# EAGLE design PiBoard1.1 (EAGLE 7.6.0)
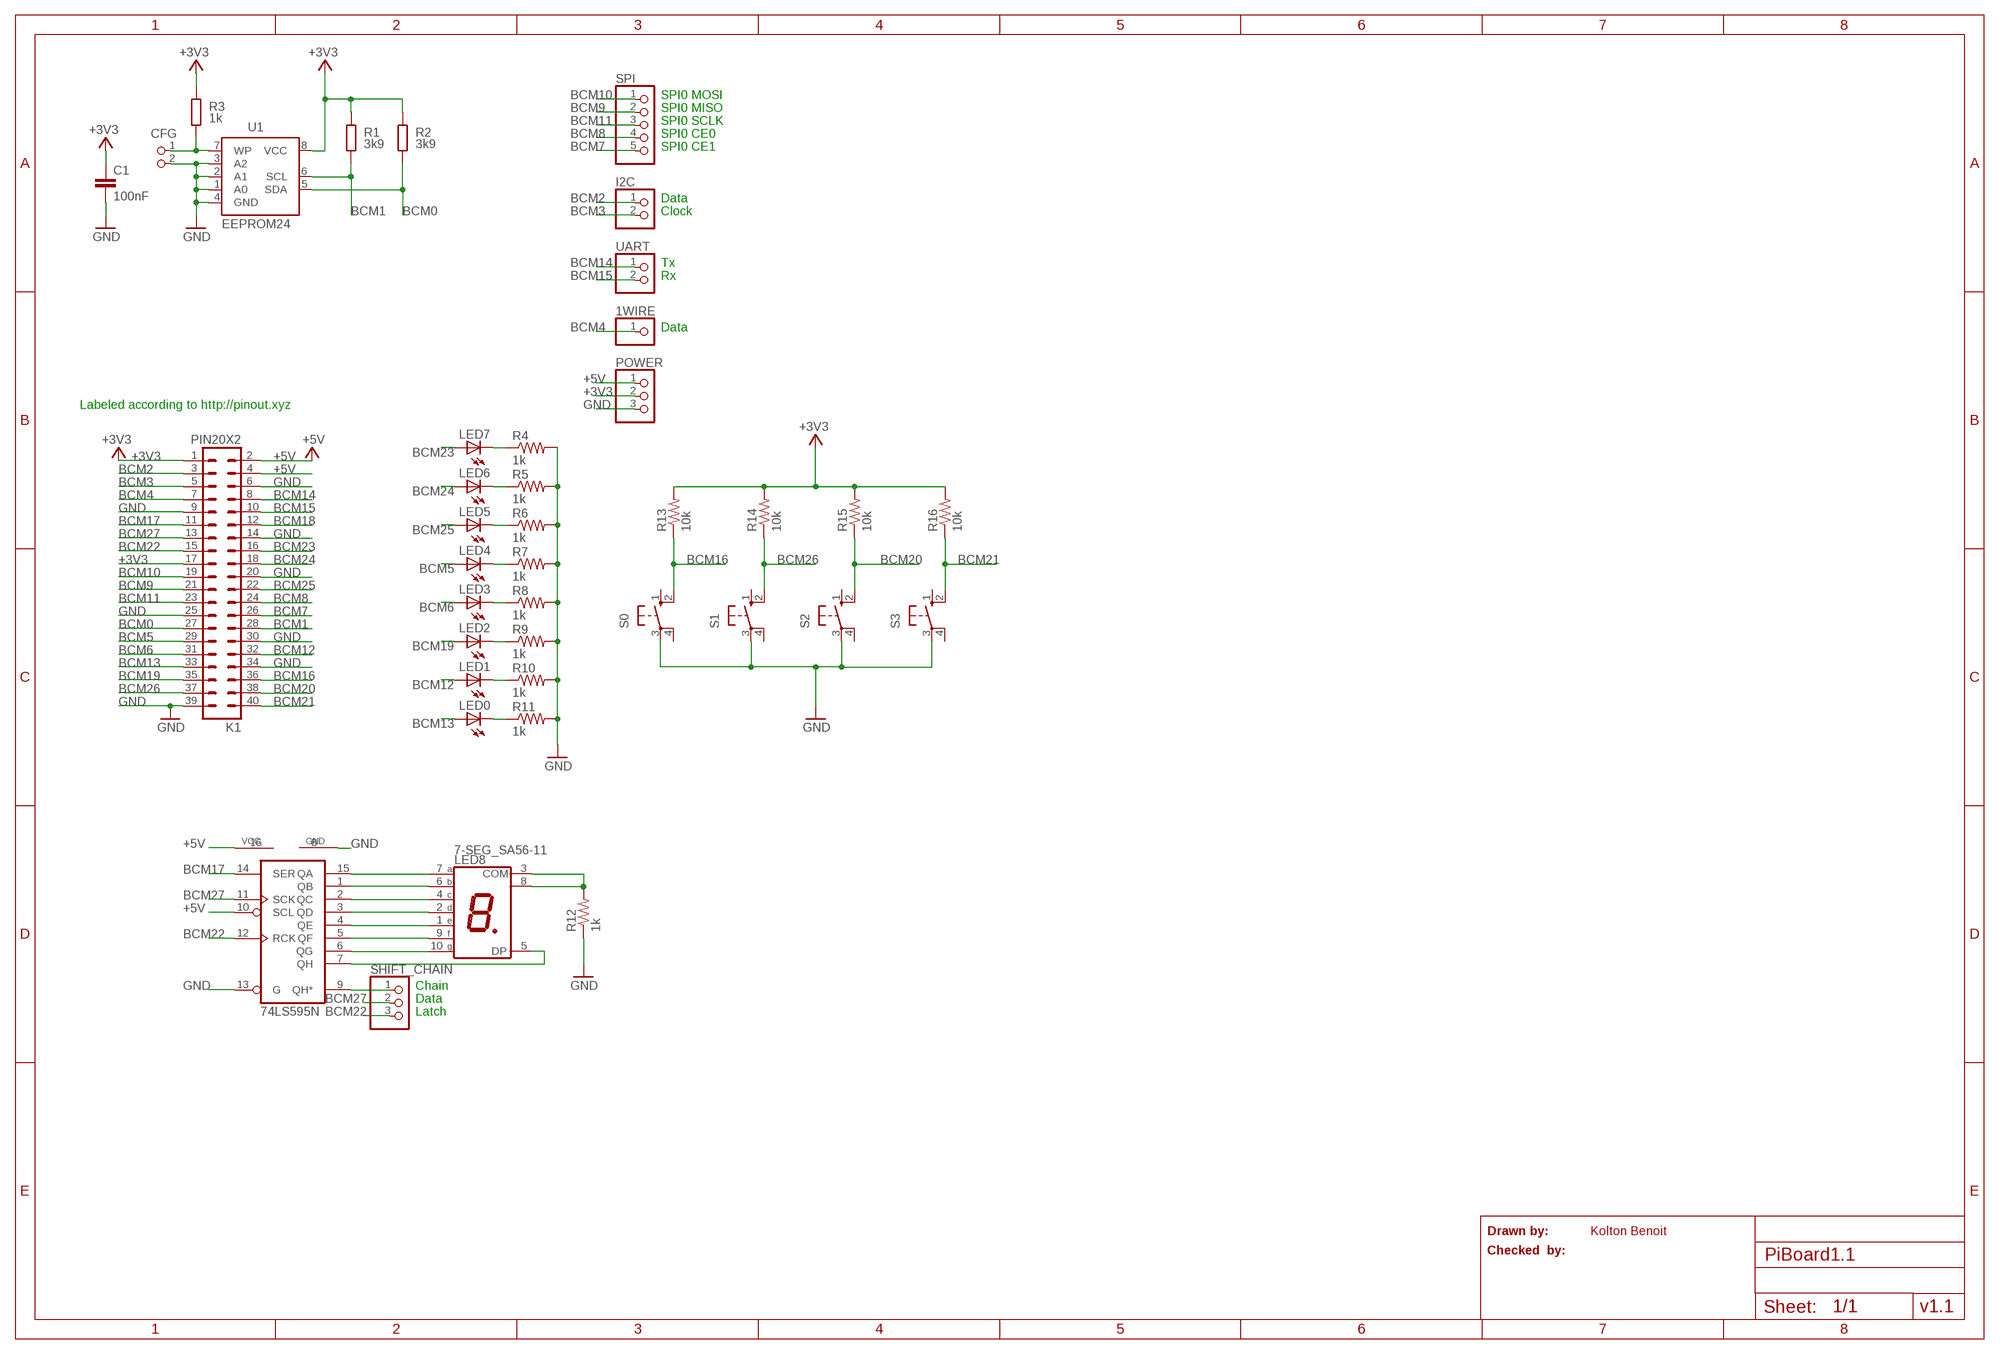
[diagram p0: schematic, sheet 1]

## Parts
1WIRE  PINHD-1X1  [1X01]
C1  100nF  C-EUC0805K  [C0805K]
CFG  PIN2_100  [PIN_W_2]
I2C  PINHD-1X2  [1X02]
K1  PIN20X2  [PIN_20X2]
LED0  LED3MM  [LED3MM]
LED1  LED3MM  [LED3MM]
LED2  LED3MM  [LED3MM]
LED3  LED3MM  [LED3MM]
LED4  LED3MM  [LED3MM]
LED5  LED3MM  [LED3MM]
LED6  LED3MM  [LED3MM]
LED7  LED3MM  [LED3MM]
LED8  7-SEG_SA56-11  [SA56-11]
POWER  PINHD-1X3  [1X03]
R1  3k9  R-EU_M0805  [M0805@1]
R2  3k9  R-EU_M0805  [M0805@1]
R3  1k  R-EU_M0805  [M0805@1]
R4  1k  R-US_0204/7  [0204/7]
R5  1k  R-US_0204/7  [0204/7]
R6  1k  R-US_0204/7  [0204/7]
R7  1k  R-US_0204/7  [0204/7]
R8  1k  R-US_0204/7  [0204/7]
R9  1k  R-US_0204/7  [0204/7]
R10  1k  R-US_0204/7  [0204/7]
R11  1k  R-US_0204/7  [0204/7]
R12  1k  R-US_0204/7  [0204/7]
R13  10k  R-US_0204/7  [0204/7]
R14  10k  R-US_0204/7  [0204/7]
R15  10k  R-US_0204/7  [0204/7]
R16  10k  R-US_0204/7  [0204/7]
S0  10-XX  [B3F-10XX]
S1  10-XX  [B3F-10XX]
S2  10-XX  [B3F-10XX]
S3  10-XX  [B3F-10XX]
SHIFT  74LS595N  [DIL16]
SHIFT_CHAIN  PINHD-1X3  [1X03]
SPI  PINHD-1X5  [1X05]
U1  EEPROM24  [SOIC8]
UART  PINHD-1X2  [1X02]

## Nets
+3V3: C1.1 K1.1 K1.17 POWER.2 R1.2 R2.2 R3.2 R13.2 R14.2 R15.2 R16.2 U1.8(VCC)
+5V: K1.2 K1.4 POWER.1 SHIFT.10(SCL) SHIFT.16(VCC)
BCM0: K1.27 R2.1 U1.5(SDA)
BCM1: K1.28 R1.1 U1.6(SCL)
BCM2: I2C.1 K1.3
BCM3: I2C.2 K1.5
BCM4: 1WIRE.1 K1.7
BCM5: K1.29 LED4.A
BCM6: K1.31 LED3.A
BCM7: K1.26 SPI.5
BCM8: K1.24 SPI.4
BCM9: K1.21 SPI.2
BCM10: K1.19 SPI.1
BCM11: K1.23 SPI.3
BCM12: K1.32 LED1.A
BCM13: K1.33 LED0.A
BCM14: K1.8 UART.1
BCM15: K1.10 UART.2
BCM16: K1.36 R13.1 S0.2(S1)
BCM17: K1.11 SHIFT.14(SER)
BCM18: K1.12
BCM19: K1.35 LED2.A
BCM20: K1.38 R15.1 S2.2(S1)
BCM21: K1.40 R16.1 S3.2(S1)
BCM22: K1.15 SHIFT.12(RCK) SHIFT_CHAIN.3
BCM23: K1.16 LED7.A
BCM24: K1.18 LED6.A
BCM25: K1.22 LED5.A
BCM26: K1.37 R14.1 S1.2(S1)
BCM27: K1.13 SHIFT.11(SCK) SHIFT_CHAIN.2
GND: C1.2 CFG.2 K1.6 K1.9 K1.14 K1.20 K1.25 K1.30 K1.34 K1.39 POWER.3 R4.2 R5.2 R6.2 R7.2 R8.2 R9.2 R10.2 R11.2 R12.1 S0.3(P) S1.3(P) S2.3(P) S3.3(P) SHIFT.8(GND) SHIFT.13(G) U1.1(A0) U1.2(A1) U1.3(A2) U1.4(GND)
N$3: CFG.1 R3.1 U1.7(WP)
N$4: LED8.7(A) SHIFT.15(QA)
N$5: LED8.6(B) SHIFT.1(QB)
N$6: LED8.4(C) SHIFT.2(QC)
N$7: LED8.2(D) SHIFT.3(QD)
N$8: LED8.1(E) SHIFT.4(QE)
N$9: LED8.9(F) SHIFT.5(QF)
N$10: LED8.10(G) SHIFT.6(QG)
N$11: LED8.5(DP) SHIFT.7(QH)
N$16: LED0.K(C) R11.1
N$17: LED1.K(C) R10.1
N$18: LED2.K(C) R9.1
N$19: LED3.K(C) R8.1
N$20: LED4.K(C) R7.1
N$21: LED5.K(C) R6.1
N$22: LED6.K(C) R5.1
N$23: LED7.K(C) R4.1
N$24: SHIFT.9(QH*) SHIFT_CHAIN.1
N$25: LED8.3(COM) LED8.8(COM) R12.2
Unconnected: S0.1(S) S0.4(P1) S1.1(S) S1.4(P1) S2.1(S) S2.4(P1) S3.1(S) S3.4(P1)

## Notes on the sheet
- SPI0 MOSI
- SPI0 MISO
- SPI0 SCLK
- SPI0 CE0
- SPI0 CE1
- Data
- Clock
- Tx
- Rx
- Data
- Labeled according to http://pinout.xyz
- Chain
- Data
- Latch
- Drawn by: | Kolton Benoit
- Checked  by:
- v1.1

## Library data of the parts
1WIRE = pinhead:PINHD-1X1: PIN HEADER
C1 = resistor:C-EU: CAPACITOR, European symbol; DIELECTRIC: X7R
CFG = FLYFISH:PIN2
I2C UART = pinhead:PINHD-1X2: PIN HEADER
K1 = FLYFISH:PIN20X2
LED0 LED1-LED7 = led:LED: LED OSRAM: - CHIPLED LG R971, LG N971, LY N971, LG Q971, LY Q971, LO R971, LY R971 LH N974, LH R974 LS Q976, LO Q976, LY Q976 LO Q996 - Hyper CHIPLED LW Q18S LB Q993, LB Q99A, LB R99A - SideLED LS A670, LO A670, LY A670, LG A670, LP A670 LB A673, LV A673, LT A673, LW A673 LH A674 LY A675 LS A676, LA A676, LO A676, LY A676, LW A676 LS A679, LY A679, LG A679 - Hyper Micro SIDELED® LS Y876, LA Y876, LO Y876, LY Y876 LT Y87S - SmartLED LW L88C, LW L88S LB L89C, LB L89S, LG L890 LS L89K, LO L89K, LY L89K LS L896, LA L896, LO L896, LY L896 - TOPLED LS T670, LO T670, LY T670, LG T670, LP T670 LSG T670, LSP T670, LSY T670, LOP T670, LYG T670 LG T671, LOG T671, LSG T671 LB T673, LV T673, LT T673, LW T673 LH T674 LS T676, LA T676, LO T676, LY T676, LB T676, LH T676, LSB T676, LW T676 LB T67C, LV T67C, LT T67C, LS T67K, LO T67K, LY T67K, LW E67C LS E67B, LA E67B, LO E67B, LY E67B, LB E67C, LV E67C, LT E67C LW T67C LS T679, LY T679, LG T679 LS T770, LO T770, LY T770, LG T770, LP T770 LB T773, LV T773, LT T773, LW T773 LH T774 LS E675, LA E675, LY E675, LS T675 LS T776, LA T776, LO T776, LY T776, LB T776 LHGB T686 LT T68C, LB T68C - Hyper Mini TOPLED® LB M676 - Mini TOPLED Santana® LG M470 LS M47K, LO M47K, LY M47K Source: http://www.osram.convergy.de LUXEON: - LUMILED® LXK2-PW12-R00, LXK2-PW12-S00, LXK2-PW14-U00, LXK2-PW14-V00 LXK2-PM12-R00, LXK2-PM12-S00, LXK2-PM14-U00 LXK2-PE12-Q00, LXK2-PE12-R00, LXK2-PE12-S00, LXK2-PE14-T00, LXK2-PE14-U00 LXK2-PB12-K00, LXK2-PB12-L00, LXK2-PB12-M00, LXK2-PB14-N00, LXK2-PB14-P00, LXK2-PB14-Q00 LXK2-PR12-L00, LXK2-PR12-M00, LXK2-PR14-Q00, LXK2-PR14-R00 LXK2-PD12-Q00, LXK2-PD12-R00, LXK2-PD12-S00 LXK2-PH12-R00, LXK2-PH12-S00 LXK2-PL12-P00, LXK2-PL12-Q00, LXK2-PL12-R00 Source: www.luxeon.com KINGBRIGHT: KA-3528ASYC Source: www.kingbright.com
LED8 = display-kingbright:7-SEG_: Kingbright 14.2mm (0.56 INCH) SINGLE DIGIT NUMERIC DUISPLAY Source: SA56-11EWA(Ver1189471036.pdf; OC_FARNELL: unknown; OC_NEWARK: unknown
POWER SHIFT_CHAIN = pinhead:PINHD-1X3: PIN HEADER
R1-R3 = resistor:R-EU_: RESISTOR, European symbol; TOLERANCE: 5%
R4-R16 = resistor:R-US_: RESISTOR, American symbol
S0 S1-S3 = switch-omron:10-XX: OMRON SWITCH; MPN: B3F-1000; OC_FARNELL: 176432; OC_NEWARK: 36M3542
SHIFT = 74xx-us:74*595: 8-bit SHIFT REGISTER, output latch
SPI = pinhead:PINHD-1X5: PIN HEADER
U1 = FLYFISH:EEPROM24

## Board
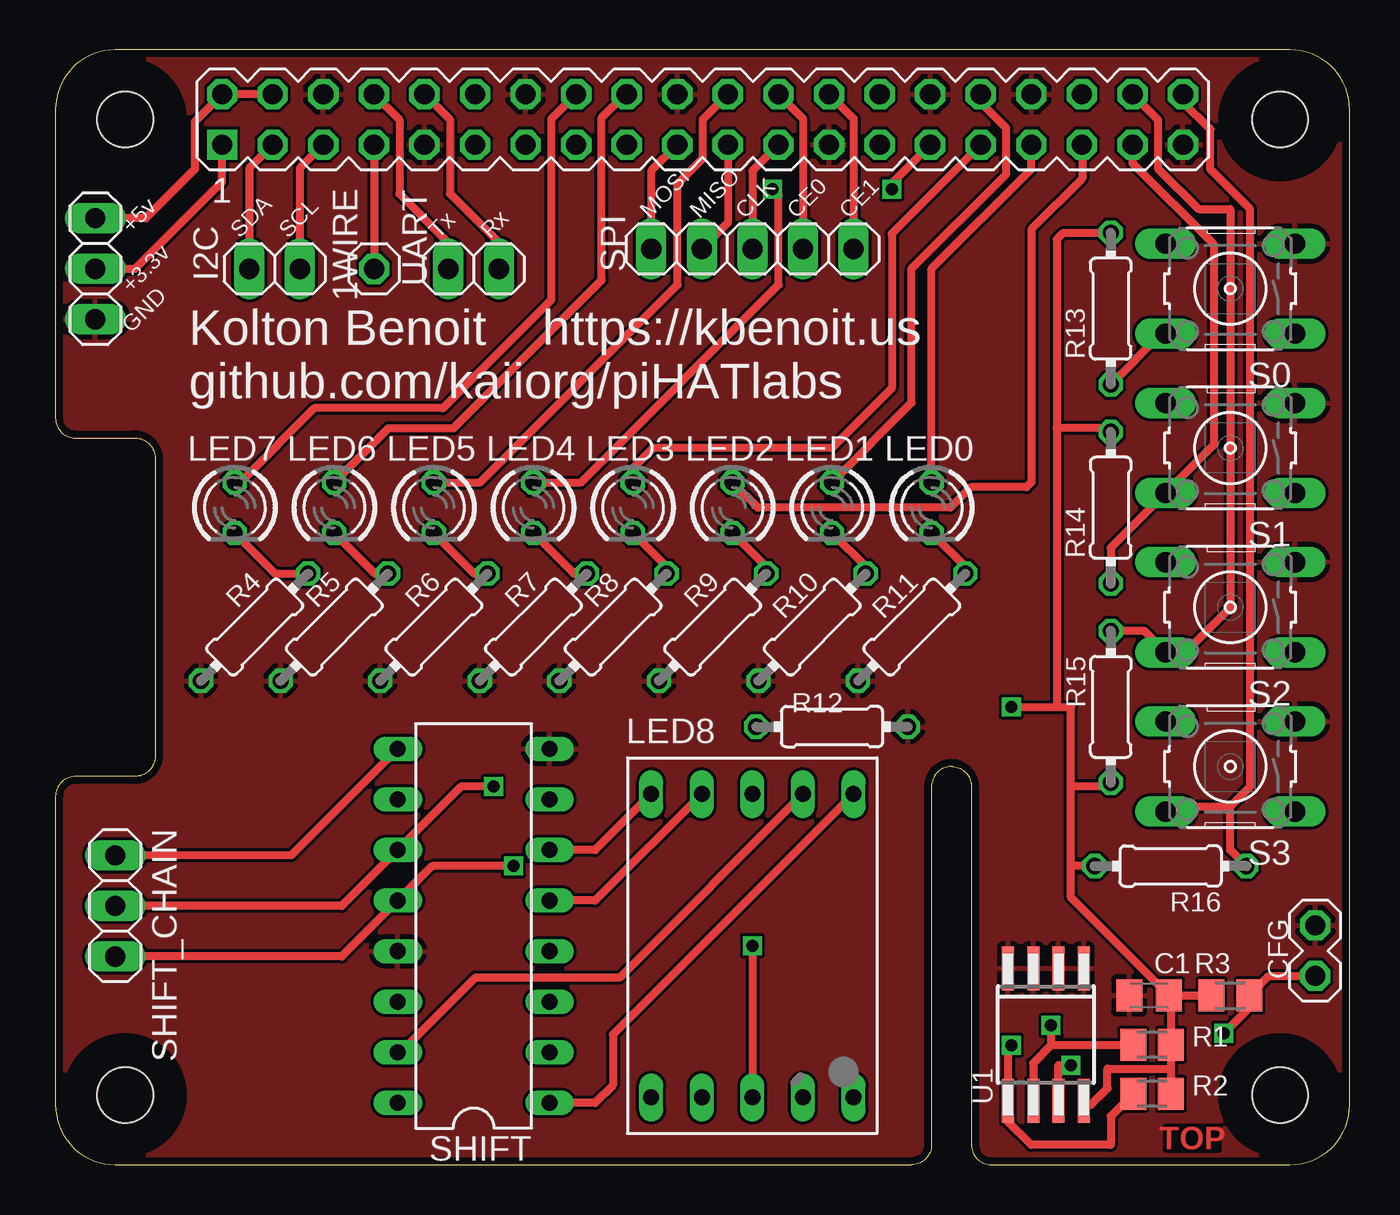
[diagram p1: board, top side]
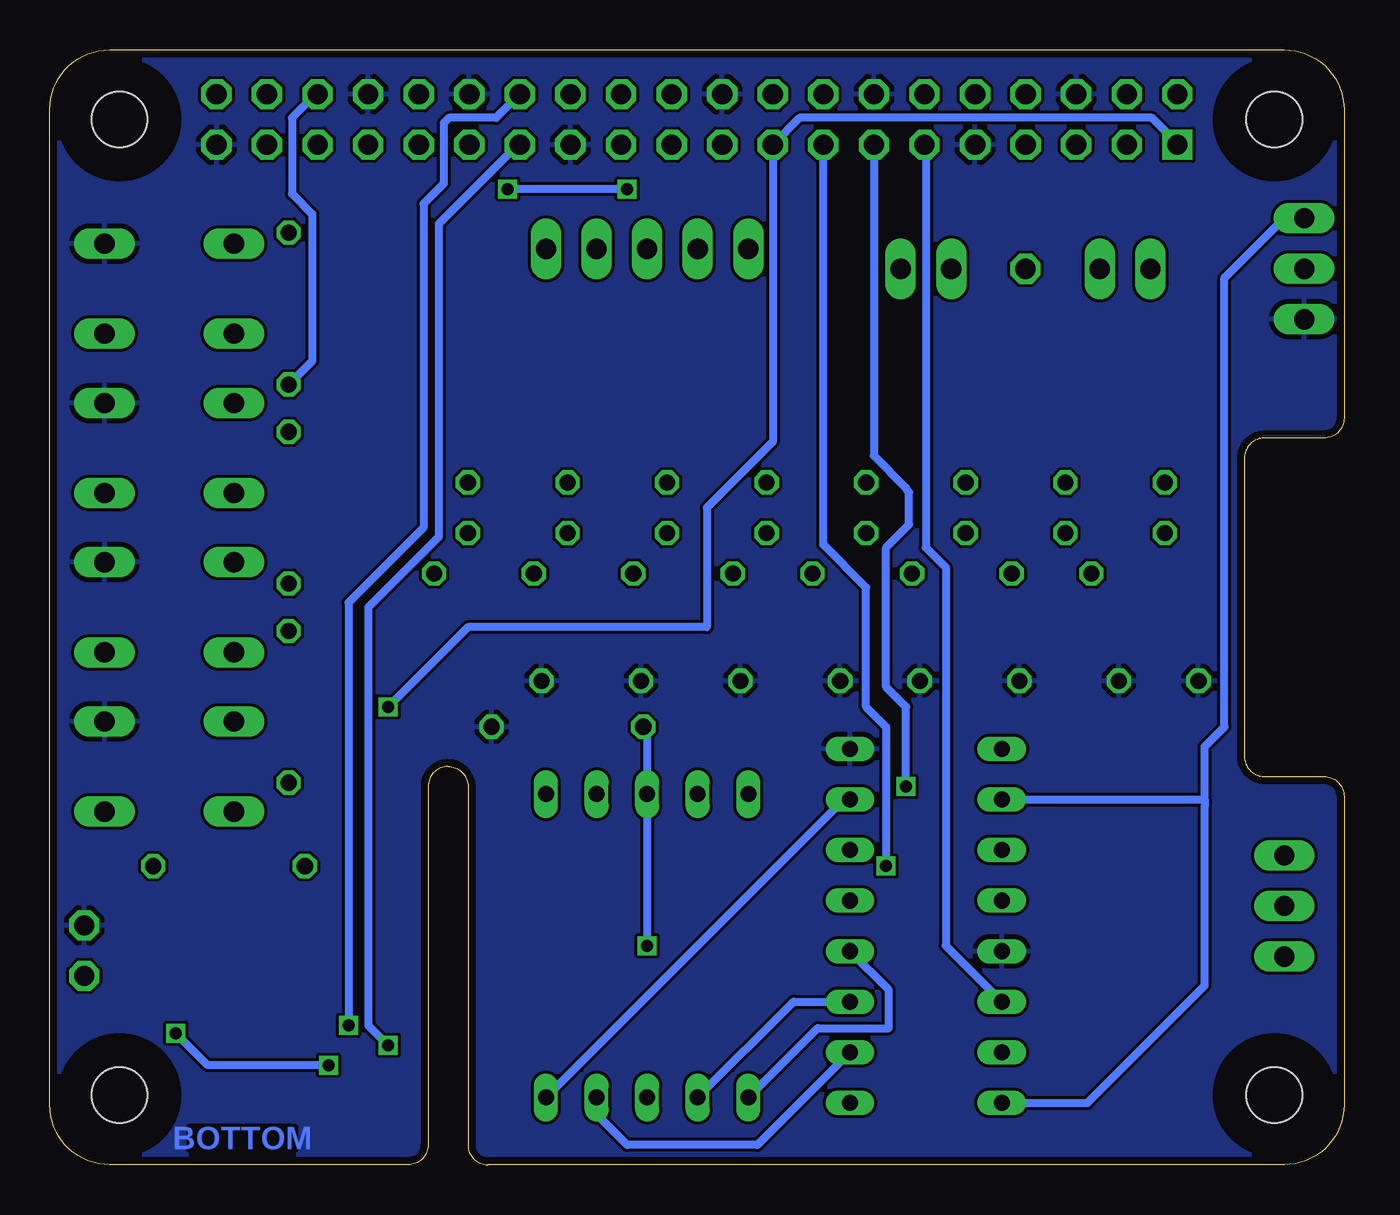
[diagram p2: board, bottom side, seen from below]

Size 65 x 56 mm. Coordinates in mm from the lower left corner, seen from the top.
Outline: 0,3 arc90 3,0 43,0 arc90 44,1 44,19 arc-90 45,20 arc-90 46,19 46,1 arc90 47,0 62,0 arc90 65,3 65,53 arc90 62,56 3,56 arc90 0,53 0,37.5 arc90 1,36.5 4,36.5 arc-90 5,35.5 5,20.5 arc-90 4,19.5 1,19.5 arc90 0,18.5 0,3
Copper layers (1*16): Top 0.0356mm / dielectric 1.5011mm / Bottom 0.0356mm
Design rules "oshpark-2layer": minimum track width 6mil, minimum drill 13mil, track to track 6mil, track to pad 6mil, pad to pad 6mil, via to via 6mil, smd to smd 6mil, copper to edge 15mil, drill to drill 6mil, minimum pad ring 7mil, minimum via ring 7mil, stop-mask expansion 2.5mil, vias tented up to drill 0mil, thermal gap 10mil
Holes 2.8 mm at 3.5,3.5 3.5,52.5 61.5,52.5 61.5,3.5
tRestrict: area 1.9,51 to 5,54; area 60,51 to 63,54; area 60,1.9 to 63,5; area 1.9,1.9 to 5,5
bRestrict: area 1.9,1.9 to 5,5; area 1.9,51 to 5,54; area 60,1.9 to 63,5; area 60,51 to 63,54

### Footprints (pad centres in the part's own frame; a part is rotated, then mirrored left to right if it is on the bottom)
1X01 = drill 1.016 octagon: 1 0,0
C0805K = smd 1.3 x 1.6: 1 -1,0; 2 1,0
PIN_W_2 = drill 1.016 octagon: 1 0,0; 2 0,-2.54
1X02 = drill 1.016 long: 1 -1.27,0; 2 1.27,0
PIN_20X2 = drill 1.016 square: 1 -24.13,-1.27 | drill 1.016 octagon: 2 -24.13,1.27; 3 -21.59,-1.27; 4 -21.59,1.27; 5 -19.05,-1.27; 6 -19.05,1.27; 7 -16.51,-1.27; 8 -16.51,1.27; 9 -13.97,-1.27; 10 -13.97,1.27; 11 -11.43,-1.27; 12 -11.43,1.27; 13 -8.89,-1.27; 14 -8.89,1.27; 15 -6.35,-1.27; 16 -6.35,1.27; 17 -3.81,-1.27; 18 -3.81,1.27; 19 -1.27,-1.27; 20 -1.27,1.27; 21 1.27,-1.27; 22 1.27,1.27; 23 3.81,-1.27; 24 3.81,1.27; 25 6.35,-1.27; 26 6.35,1.27; 27 8.89,-1.27; 28 8.89,1.27; 29 11.43,-1.27; 30 11.43,1.27; 31 13.97,-1.27; 32 13.97,1.27; 33 16.51,-1.27; 34 16.51,1.27; 35 19.05,-1.27; 36 19.05,1.27; 37 21.59,-1.27; 38 21.59,1.27; 39 24.13,-1.27; 40 24.13,1.27
LED3MM = drill 0.813 octagon: A -1.27,0; K 1.27,0
SA56-11 = drill 0.8 long: 1 -5.08,-7.62; 2 -2.54,-7.62; 3 0,-7.62; 4 2.54,-7.62; 5 5.08,-7.62; 6 5.08,7.62; 7 2.54,7.62; 8 0,7.62; 9 -2.54,7.62; 10 -5.08,7.62
1X03 = drill 1.016 long: 1 -2.54,0; 2 0,0; 3 2.54,0
M0805@1 = smd 1.3 x 1.6: 1 -0.95,0; 2 0.95,0
0204/7 = drill 0.813 octagon: 1 -3.81,0; 2 3.81,0
B3F-10XX = drill 1.016 long: 1 -3.251,2.261; 2 3.251,2.261; 3 -3.251,-2.261; 4 3.251,-2.261
DIL16 = drill 0.813 long: 1 -8.89,-3.81; 2 -6.35,-3.81; 3 -3.81,-3.81; 4 -1.27,-3.81; 5 1.27,-3.81; 6 3.81,-3.81; 7 6.35,-3.81; 8 8.89,-3.81; 9 8.89,3.81; 10 6.35,3.81; 11 3.81,3.81; 12 1.27,3.81; 13 -1.27,3.81; 14 -3.81,3.81; 15 -6.35,3.81; 16 -8.89,3.81
1X05 = drill 1.016 long: 1 -5.08,0; 2 -2.54,0; 3 0,0; 4 2.54,0; 5 5.08,0
SOIC8 = smd 0.6 x 2.2: 1 -1.905,-3.33; 2 -0.635,-3.33; 3 0.635,-3.33; 4 1.905,-3.33; 5 1.905,3.33; 6 0.635,3.33; 7 -0.635,3.33; 8 -1.905,3.33

### Placement (x,y rotation side)
1WIRE  16,45 0 top
C1  54.92,8.5 180 top
CFG  63.27,9.48 180 top
I2C  11,45 0 top
K1  32.5,52.5 0 top
LED0  44,33 270 top
LED1  39,33 270 top
LED2  34,33 270 top
LED3  29,33 270 top
LED4  24,33 270 top
LED5  19,33 270 top
LED6  14,33 270 top
LED7  9,33 270 top
LED8  35,11 0 top
POWER  2,45 270 top
R1  55.08,6.02 0 top
R2  55.08,3.56 0 top
R3  59.01,8.5 180 top
R4  10,27 225 top
R5  14,27 225 top
R6  19,27 225 top
R7  24,27 225 top
R8  28,27 225 top
R9  33,27 225 top
R10  38,27 225 top
R11  43,27 225 top
R12  39,22 180 top
R13  53,43 90 top
R14  53,33 90 top
R15  53,23 270 top
R16  56,15 180 top
S0  59,44 180 top
S1  59,36 180 top
S2  59,28 180 top
S3  59,20 180 top
SHIFT  21,12 90 top
SHIFT_CHAIN  3,13 270 top
SPI  35,46 0 top
U1  49.74,6.54 180 top
UART  21,45 0 top

### Tracks (layer width: path | path; a pad name or v marks a point on that pad's centre or on a via)
+3V3  (via drill 0.6)
  Top 0.406: POWER.2 4,45 8.37,49.37 K1.1 | v48,23 50.29,23 | 50.29,23 51,23 51,19 | 50.29,37 50.29,46.48 50.62,46.81 R13.2 | 50.29,37 50.29,23 | 56.02,8.4 C1.1 51,13.43 51,15 | 56.02,8.4 R1.2 56.02,4.83 | 56.02,4.83 R2.2 | 56.02,8.4 56.12,8.5 R3.2 | U1.8 51.85,3 52,3 52.83,3.83 52.83,4.83 56.02,4.83 | 51,15 51,19 | R16.2 51,15 | R15.2 52.81,19 51,19 | R14.2 52.81,37 50.29,37
  Bottom 0.406: K1.1 8.37,51.3 9.65,52.58 27.34,52.58 K1.17 28.69,36.31 32,33 32,27 44,27 v48,23
+5V
  Top 0.406: POWER.1 4.54,47.54 7,50 7,52.4 K1.2 K1.4
  Bottom 0.406: SHIFT.16 12.89,3.11 7,9 7,18 7,18.35 | 7,18.35 7,21 6,22 6,44.54 3,47.54 POWER.1 | SHIFT.10 7,18.35
BCM0  (via drill 0.6)
  Top 0.406: R2.1 53,2.44 53,1 49,1 47.84,2.17 U1.5 47.84,5.83 v48,6
  Bottom 0.406: K1.27 41.48,51.23 45.47,47.24 45.47,31.53 49,28 49,7 v48,6
BCM1  (via drill 0.6)
  Top 0.406: R1.1 arc-90 54.1,6 50,6 | 50,6 49.1,5.11 U1.6 | v50,7 50,6
  Bottom 0.406: K1.28 42.58,52.58 44.96,52.58 45.21,52.32 45.21,49.28 46.23,48.26 46.23,32 50,28.23 v50,7
BCM2
  Top 0.406: K1.3 9.73,50.05 I2C.1
BCM3
  Top 0.406: K1.5 12.27,50.05 I2C.2
BCM4
  Top 0.406: K1.7 1WIRE.1
BCM5  (via drill 0.6)
  Top 0.406: LED4.A 26.4,34.27 36.32,44.2 36.32,48.68 v36,49 | v42,49 42,49.3 K1.29
  Bottom 0.406: v36,49 v42,49
BCM6
  Top 0.406: K1.31 42,46.76 42,39 39,36 30,36 29,35 LED3.A
BCM7
  Top 0.406: K1.26 40.08,52.54 SPI.5
BCM8
  Top 0.406: K1.24 37.54,52.54 SPI.4
BCM9
  Top 0.406: K1.21 33.77,47.31 SPI.2
BCM10
  Top 0.406: K1.19 29.92,49.92 SPI.1
BCM11
  Top 0.406: K1.23 35,49.92 SPI.3
BCM12
  Top 0.406: LED1.A 43,38.27 43,45 47.75,49.75 47.75,52.07 46.47,53.35 K1.32
BCM13
  Top 0.406: LED0.A 44,45 49.01,50.01 K1.33
BCM14
  Top 0.406: K1.8 17.27,52.49 17.27,48.77 19.73,46.31 UART.1
BCM15
  Top 0.406: K1.10 19.81,52.49 19.81,48.77 22.27,46.31 UART.2
BCM16
  Top 0.406: R13.1 55.55,41.74 S0.2
  Bottom 0.406: K1.36 51.64,53.77 52.83,52.58 52.83,48.77 51.82,47.75 51.82,40.37 R13.1
BCM17
  Bottom 0.406: SHIFT.14 20,11 20,30 21,31 21,51.16 K1.11
BCM19
  Top 0.406: K1.35 51.56,51.22 51.56,49.53 49.02,46.99 49.02,34.29 48.77,34.04 45.97,34.04 44.94,33 35.27,33 LED2.A
BCM20
  Top 0.406: K1.38 55.37,52.49 55.37,50.04 57.41,48 59,48 59,28 56.74,25.74 S2.2 54.68,26.81 R15.1
BCM21
  Top 0.406: S3.2 56.01,18 59,18 | 59,18 60,19 60,48 58,50 58,52 56.63,53.37 K1.40 | R16.1 59,15.81 59,18
BCM22  (via drill 0.6)
  Top 0.406: v23,15 18.92,15 SHIFT.12 14.38,10.46 SHIFT_CHAIN.3
  Bottom 0.406: v23,15 23,22 24,23 24,29 26.15,31.15 K1.15
BCM23
  Top 0.406: K1.16 24.89,52.51 24.89,43.43 19.46,38 13,38 9.27,34.27 LED7.A
BCM24
  Top 0.406: LED6.A 16.73,37 20,37 27.43,44.43 27.43,52.58 28.62,53.77 K1.18
BCM25
  Top 0.406: LED5.A 21.32,34.27 31.24,44.2 31.24,49.28 32.51,50.55 32.51,52.51 K1.22
BCM26
  Top 0.406: K1.37 54.09,50.3 58.17,46.23 58.17,36.17 58,36 58,35.99 S1.2 53,30.99 R14.1
BCM27  (via drill 0.6)
  Top 0.406: v22,19 20.38,19 SHIFT.11 14.38,13 SHIFT_CHAIN.2
  Bottom 0.406: K1.13 23.61,35.61 22,34 22,33.94 21.84,33.78 21.84,32.16 23,31 23,24 22,23 22,19.31 21.84,19.16 v22,19
GND
  pour Bottom: 0,3 arc90 3,0 43,0 arc90 44,1 44,19 arc-90 45,20 arc-90 46,19 46,1 arc90 47,0 62,0 arc90 65,3 65,53 arc90 62,56 3,56 arc90 0,53 0,37.5 arc90 1,36.5 4,36.5 arc-90 5,35.5 5,20.5 arc-90 4,19.5 1,19.5 arc90 0,18.5
  pour Top: 0,3 arc90 3,0 43,0 arc90 44,1 44,19 arc-90 45,20 arc-90 46,19 46,1 arc90 47,0 62,0 arc90 65,3 65,53 arc90 62,56 3,56 arc90 0,53 0,37.5 arc90 1,36.5 4,36.5 arc-90 5,35.5 5,20.5 arc-90 4,19.5 1,19.5 arc90 0,18.5
N$3  (via drill 0.6)
  Top 0.406: CFG.1 60.94,9.48 R3.1 59.95,7.88 v58.67,6.6 | U1.7 50.38,5 v51,5
  Bottom 0.406: v51,5 57.07,5 v58.67,6.6
N$4
  Top 0.406: LED8.7 28.32,9.4 21.08,9.4 17.33,5.65 SHIFT.15
N$5
  Top 0.406: LED8.6 28,6.54 28,4 27.11,3.11 SHIFT.1
N$6
  Bottom 0.406: SHIFT.2 29.46,1 36,1 37.54,2.54 LED8.4
N$7
  Bottom 0.406: LED8.2 27.65,8.19 SHIFT.3
N$8
  Bottom 0.406: LED8.1 26.44,6.86 22.86,6.86 22.86,8.78 SHIFT.4
N$9
  Top 0.406: LED8.9 27.11,13.27 SHIFT.5
N$10
  Top 0.406: LED8.10 27.11,15.81 SHIFT.6
N$11
  Bottom 0.406: SHIFT.7 25.11,18.35 LED8.5
N$16
  Top 0.406: LED0.K 45.69,30.04 R11.1
N$17
  Top 0.406: LED1.K 40.69,30.04 R10.1
N$18
  Top 0.406: LED2.K 35.69,30.04 R9.1
N$19
  Top 0.406: LED3.K 30.69,30.04 R8.1
N$20
  Top 0.406: LED4.K 26.04,29.69 R7.1
N$21
  Top 0.406: LED5.K 21.04,29.69 R6.1
N$22
  Top 0.406: LED6.K 16.04,29.69 R5.1
N$23
  Top 0.406: LED7.K 11.04,29.69 R4.1
N$24
  Top 0.406: SHIFT.9 11.84,15.54 SHIFT_CHAIN.1
N$25  (via drill 0.6)
  Top 0.406: v35,11 LED8.3
  Bottom 0.406: v35,11 LED8.8 35,21.81 R12.2

### Text on the board
Top: TOP
Bottom: BOTTOM
tPlace: +5v | MOSI | MISO | CLK | CE0 | CE1 | SDA | SCL | Tx | Rx | +3.3v | GND | Kolton Benoit https://kbenoit.us / github.com/kaiiorg/piHATlabs